# EAGLE schematic Taser gun (EAGLE 9.6.0)
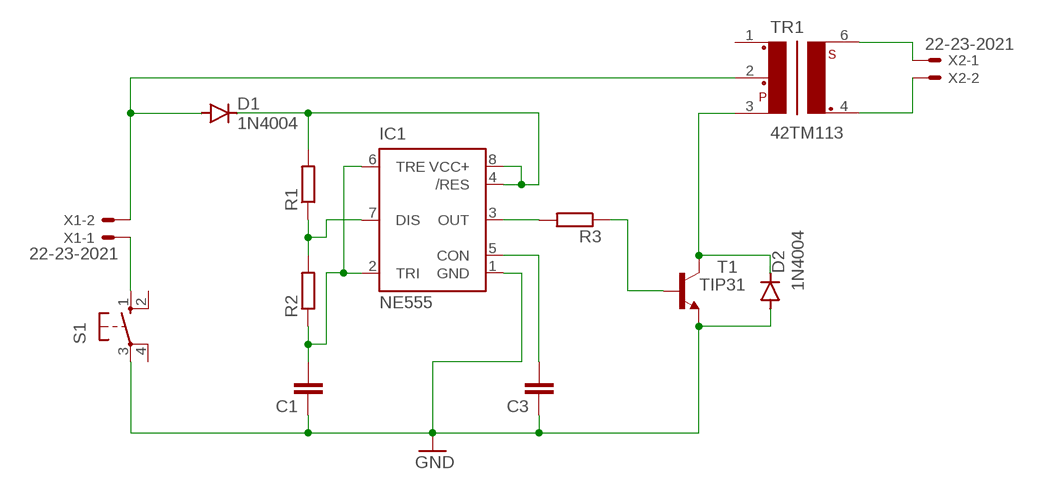
[diagram p0: schematic, sheet 1]

## Parts
C1  C-EU025-030X050  [C025-030X050]
C3  C-EU025-030X050  [C025-030X050]
D1  1N4004  [DO41-10]
D2  1N4004  [DO41-10]
IC1  NE555  [DIL-08]
R1  R-EU_0204/7  [0204/7]
R2  R-EU_0204/7  [0204/7]
R3  R-EU_0204/7  [0204/7]
S1  10-XX  [B3F-10XX]
T1  TIP31  [TO220]
TR1  42TM113  [42TM]
X1  22-23-2021  [22-23-2021]
X2  22-23-2021  [22-23-2021]

## Nets
GND: C1.1 C3.1 D2.A IC1.1(GND) S1.3(P) T1.3(E)
N$1: IC1.7(DIS) R1.1 R2.2
N$2: D1.C IC1.4(/RES) IC1.8(VCC+) R1.2
N$3: C1.2 IC1.2(TRI) IC1.6(TRE) R2.1
N$4: C3.2 IC1.5(CON)
N$5: IC1.3(OUT) R3.2
N$6: R3.1 T1.1(B)
N$7: D2.C T1.2(C) TR1.3
N$9: D1.A TR1.2 X1.2
N$10: S1.1(S) X1.1
N$11: TR1.6 X2.1
N$12: TR1.4 X2.2
Unconnected: S1.2(S1) S1.4(P1) TR1.1

## Library data of the parts
C1 C3 = rcl:C-EU: CAPACITOR, European symbol; SPICEPREFIX: C
D1 D2 = diode:1N4004: DIODE general purpose rectifier, 1 A
IC1 = st-microelectronics:NE555: General purpose bipolar Timer; MF: Arrow Electronics; MPN: NE555N; OC_FARNELL: 1467742; OC_NEWARK: 89K1486
R1-R3 = rcl:R-EU_: RESISTOR, European symbol; SPICEPREFIX: R
S1 = switch-omron:10-XX: OMRON SWITCH; MPN: B3F-1000; OC_FARNELL: 176432; OC_NEWARK: 36M3542
T1 = transistor:TIP31: NPN Transistor Medium Power Linear Switching Applications Source: http://onsemi.com
TR1 = trafo-xicon:42TM113: Transformer Mouser 42TLM Series Source: http://www.mouser.com/catalog/specsheets/164267.pdf; OC_FARNELL: unknown; OC_NEWARK: unknown
X1 X2 = con-molex:22-23-2021: .100" (2.54mm) Center Header - 2 Pin; MF: MOLEX; MPN: 22-23-2021; OC_FARNELL: 1462926; OC_NEWARK: 25C3832